# Altium schematic sheet AM-Clock.SchDoc
size A
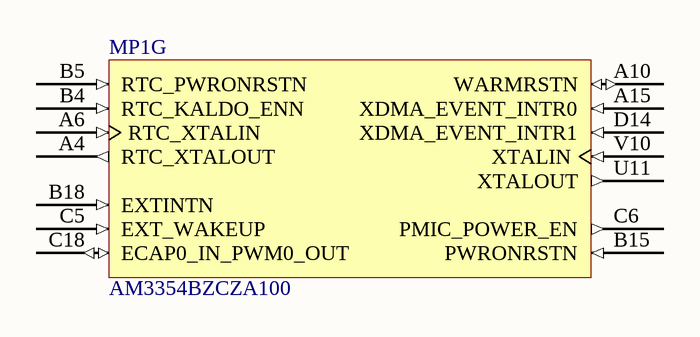
[diagram p0: AM-Clock.SchDoc]

## Parts
MP1  AM3354BZCZA100  [TI-ZCZ324]  (part G of 9)

## Nets

Not connected (* = marked no-connect by the designer): MP1 A4(RTC_XTALOUT) A6(RTC_XTALIN) A10(WARMRSTN) A15(XDMA_EVENT_INTR0) B4(RTC_KALDO_ENN) B5(RTC_PWRONRSTN) B15(PWRONRSTN) B18(EXTINTN) C5(EXT_WAKEUP) C6(PMIC_POWER_EN) C18(ECAP0_IN_PWM0_OUT) D14(XDMA_EVENT_INTR1) U11(XTALOUT) V10(XTALIN)

## Library data of the parts
MP1 = CMP-0547-00017-2: Sitara ARM Cortex-A8 32-Bit RISC Microprocessor, 1 GHz, SGX530 3D Graphics Engine, Programmable Real-Time Unit and Industrial Communication Subsystem (PRU-ICSS), -40 to 105 degC, 324-pin NFBGA (ZCZ), Green (RoHS & no Sb/Br); Manufacturer: Texas Instruments; eQEP: 3; CAN: 2; UART (SCI): 6; ComponentLink2Description: Datasheet; Mounting Technology: Surface Mount; ComponentLink3Description: Package Specification; Operating Temperature: -40 to 105 degC; PackageReference: ZCZ324; ComponentLink3URL: http://www.ti.com/lit/ds/symlink/am3352.pdf; ARM CPU: Cortex-A8; SPI: 2; ComponentLink2URL: http://www.ti.com/lit/ds/symlink/am3352.pdf; ComponentLink1URL: http://www.ti.com/; PackageVersion: 4211570/A; DatasheetVersion: SPRS717F; eCAP: 3; ComponentLink1Description: Manufacturer URL; PartNumber: AM3354BZCZA100; I2C: 3; PackageDescription: 324-Pin Plastic Ball Grid Array, Body 15 x 15 mm, Pitch 0.8 mm